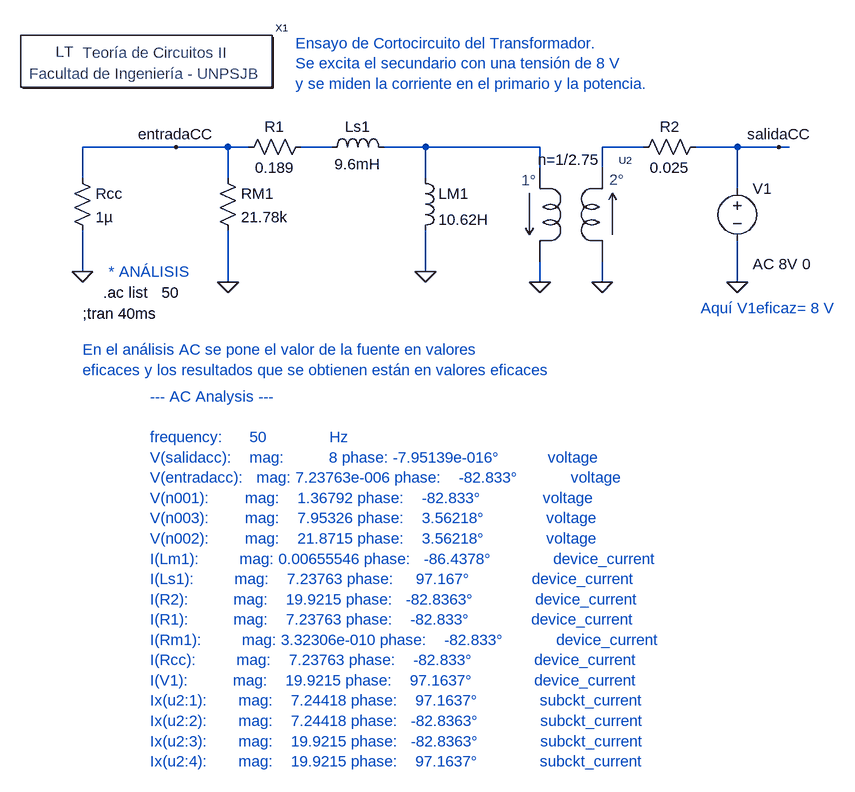
[diagram p0: schematic Ensayo de Cortocircuito del Tranformador monofásico.asc]
Ensayo de Cortocircuito del Tranformador monofásico.asc, the LTspice schematic file:
Version 4
SHEET 1 980 680
WIRE -656 -448 -800 -448
WIRE -576 -448 -656 -448
WIRE -544 -448 -576 -448
WIRE -416 -448 -464 -448
WIRE -272 -448 -336 -448
WIRE -96 -448 -272 -448
WIRE 64 -448 0 -448
WIRE 208 -448 144 -448
WIRE 272 -448 208 -448
WIRE 288 -448 272 -448
WIRE -96 -416 -96 -448
WIRE 0 -416 0 -448
WIRE -800 -400 -800 -448
WIRE -576 -400 -576 -448
WIRE -272 -400 -272 -448
WIRE 208 -384 208 -448
WIRE -800 -256 -800 -320
WIRE -272 -256 -272 -320
WIRE -576 -240 -576 -320
WIRE -96 -240 -96 -272
WIRE 0 -240 0 -272
WIRE 208 -240 208 -304
FLAG -800 -256 0
FLAG -96 -240 0
FLAG 0 -240 0
FLAG 272 -448 salidaCC
FLAG 208 -240 0
FLAG -576 -240 0
FLAG -272 -256 0
FLAG -656 -448 entradaCC
SYMBOL voltage 208 -400 R0
WINDOW 123 24 132 Left 2
WINDOW 39 0 0 Left 2
SYMATTR Value2 AC 8V 0
SYMATTR InstName V1
SYMATTR Value ""
SYMBOL res -816 -416 R0
SYMATTR InstName Rcc
SYMATTR Value 1µ
SYMBOL res -592 -416 R0
SYMATTR InstName RM1
SYMATTR Value 21.78k
SYMBOL res -448 -464 R90
WINDOW 0 0 56 VBottom 2
WINDOW 3 32 56 VTop 2
SYMATTR InstName R1
SYMATTR Value 0.189
SYMBOL res 160 -464 R90
WINDOW 0 0 56 VBottom 2
WINDOW 3 32 56 VTop 2
SYMATTR InstName R2
SYMATTR Value 0.025
SYMBOL ind -432 -432 R270
WINDOW 0 32 56 VTop 2
WINDOW 3 5 56 VBottom 2
SYMATTR InstName Ls1
SYMATTR Value 9.6mH
SYMBOL ind -288 -416 R0
SYMATTR InstName LM1
SYMATTR Value 10.62H
SYMBOL Teoría\ de\ Circuitos\ II -704 -576 R0
SYMATTR InstName X1
SYMBOL Circuitos2\\Transformadores\\trafoi -48 -352 R0
WINDOW 39 -3 -77 Center 2
SYMATTR SpiceLine n=1/2.75
SYMATTR InstName U2
TEXT -768 -224 Left 2 !.ac list   50
TEXT -800 -192 Left 2 !;tran 40ms
TEXT -800 -136 Left 2 ;En el análisis AC se pone el valor de la fuente en valores\neficaces y los resultados que se obtienen están en valores eficaces
TEXT 152 -200 Left 2 ;Aquí V1eficaz= 8 V
TEXT -472 -608 Left 2 ;Ensayo de Cortocircuito del Transformador.\nSe excita el secundario con una tensión de 8 V\ny se miden la corriente en el primario y la potencia.
TEXT -696 -64 Left 2 ;--- AC Analysis ---\n \nfrequency:      50              Hz\nV(salidacc):    mag:          8 phase: -7.95139e-016°           voltage\nV(entradacc):   mag: 7.23763e-006 phase:    -82.833°            voltage\nV(n001):        mag:    1.36792 phase:    -82.833°              voltage\nV(n003):        mag:    7.95326 phase:    3.56218°              voltage\nV(n002):        mag:    21.8715 phase:    3.56218°              voltage\nI(Lm1):         mag: 0.00655546 phase:   -86.4378°              device_current\nI(Ls1):         mag:    7.23763 phase:     97.167°              device_current\nI(R2):          mag:    19.9215 phase:   -82.8363°              device_current\nI(R1):          mag:    7.23763 phase:    -82.833°              device_current\nI(Rm1):         mag: 3.32306e-010 phase:    -82.833°            device_current\nI(Rcc):         mag:    7.23763 phase:    -82.833°              device_current\nI(V1):          mag:    19.9215 phase:    97.1637°              device_current\nIx(u2:1):       mag:    7.24418 phase:    97.1637°              subckt_current\nIx(u2:2):       mag:    7.24418 phase:   -82.8363°              subckt_current\nIx(u2:3):       mag:    19.9215 phase:   -82.8363°              subckt_current\nIx(u2:4):       mag:    19.9215 phase:    97.1637°              subckt_current
TEXT -760 -256 Left 2 ;* ANÁLISIS

The netlist it stands for:
* Ensayo de Cortocircuito del Tranformador monofásico.asc
V1 salidaCC 0 AC 8V 0
Rcc entradaCC 0 1µ
RM1 entradaCC 0 21.78k
R1 N001 entradaCC 0.189
R2 salidaCC N003 0.025
Ls1 N001 N002 9.6mH
LM1 N002 0 10.62H
XX1 Teoría de Circuitos II
XU2 N002 0 N003 0 TFI TFI n=1/2.75  ; pins 1 2 3 4
.ac list   50
;tran 40ms
* En el análisis AC se pone el valor de la fuente en valores
* eficaces y los resultados que se obtienen están en valores eficaces
* Aquí V1eficaz= 8 V
* Ensayo de Cortocircuito del Transformador.
* Se excita el secundario con una tensión de 8 V
* y se miden la corriente en el primario y la potencia.
* --- AC Analysis ---
* frequency:      50              Hz
* V(salidacc):    mag:          8 phase: -7.95139e-016°           voltage
* V(entradacc):   mag: 7.23763e-006 phase:    -82.833°            voltage
* V(n001):        mag:    1.36792 phase:    -82.833°              voltage
* V(n003):        mag:    7.95326 phase:    3.56218°              voltage
* V(n002):        mag:    21.8715 phase:    3.56218°              voltage
* I(Lm1):         mag: 0.00655546 phase:   -86.4378°              device_current
* I(Ls1):         mag:    7.23763 phase:     97.167°              device_current
* I(R2):          mag:    19.9215 phase:   -82.8363°              device_current
* I(R1):          mag:    7.23763 phase:    -82.833°              device_current
* I(Rm1):         mag: 3.32306e-010 phase:    -82.833°            device_current
* I(Rcc):         mag:    7.23763 phase:    -82.833°              device_current
* I(V1):          mag:    19.9215 phase:    97.1637°              device_current
* Ix(u2:1):       mag:    7.24418 phase:    97.1637°              subckt_current
* Ix(u2:2):       mag:    7.24418 phase:   -82.8363°              subckt_current
* Ix(u2:3):       mag:    19.9215 phase:   -82.8363°              subckt_current
* Ix(u2:4):       mag:    19.9215 phase:    97.1637°              subckt_current
* * ANÁLISIS
.lib ..\sym\Circuitos2\Transformadores\trafosideales.lib
.backanno
.end